# Altium schematic sheet 0196_LPSS - SMLINK OPTI.SchDoc
size A3
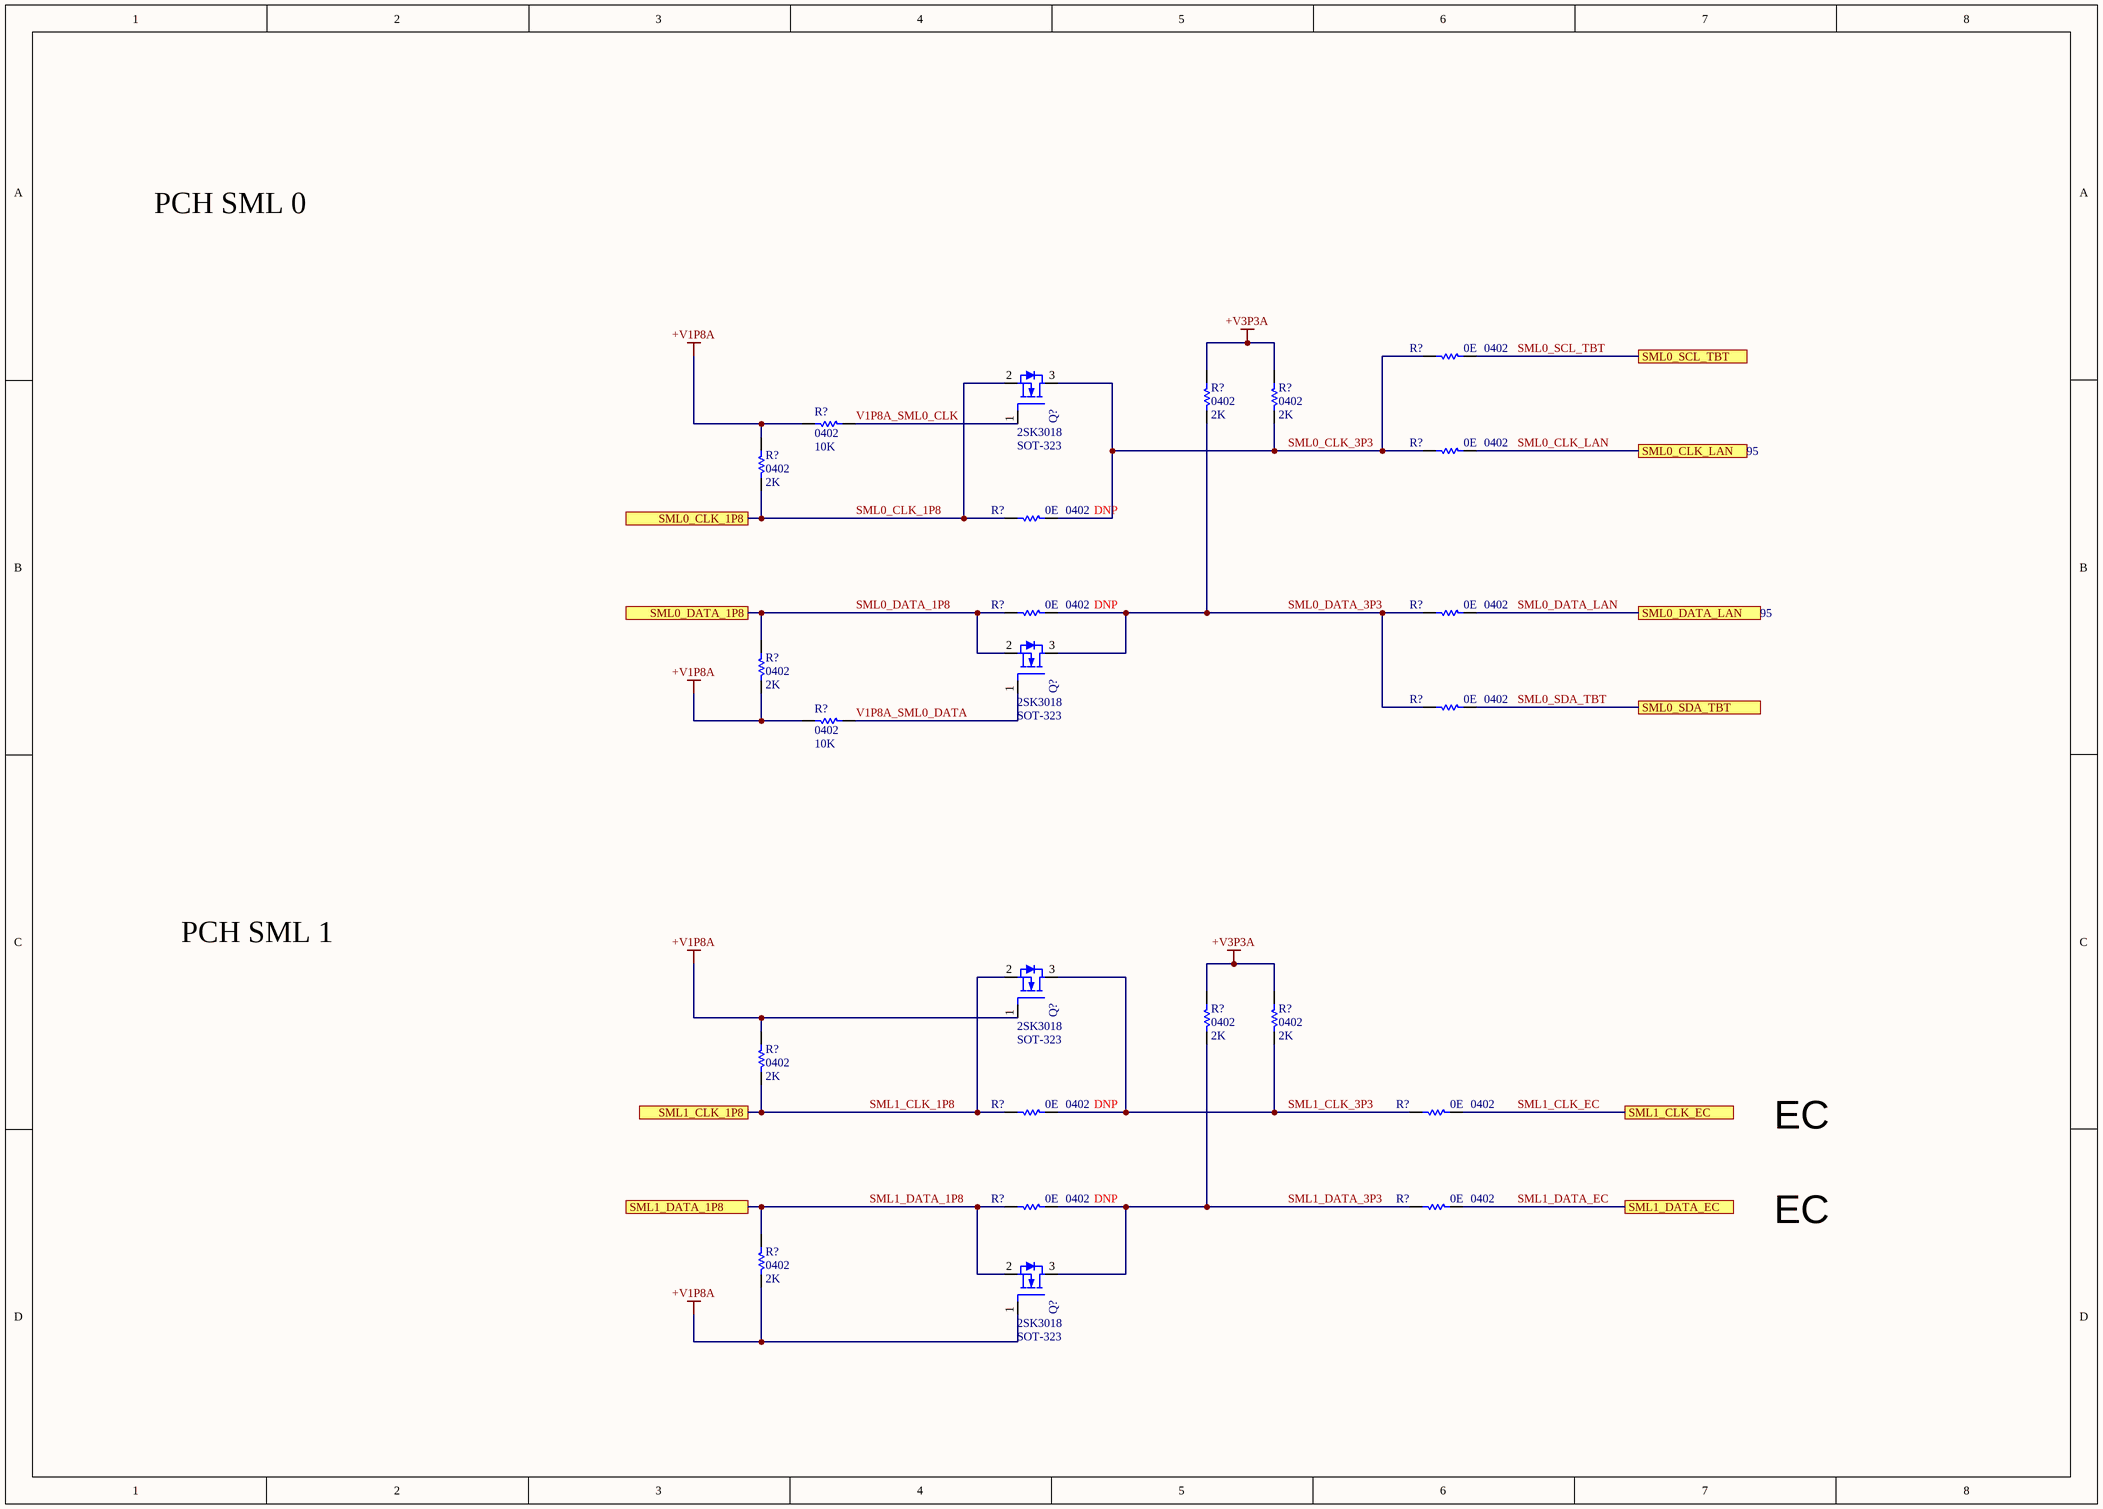
[diagram p0: 0196_LPSS - SMLINK OPTI.SchDoc]

## Parts
(Parts that share a designator on the sheet are numbered #1, #2 ... from top to bottom, then left to right.)
Q?#1  Manufacturer Part Number: 2SK3018  Case/Package: SOT-323  [SOT323]  (hidden comment: MOSFET N_2SK3018)
Q?#2  Manufacturer Part Number: 2SK3018  Case/Package: SOT-323  [SOT323]  (hidden comment: MOSFET N_2SK3018)
Q?#3  Manufacturer Part Number: 2SK3018  Case/Package: SOT-323  [SOT323]  (hidden comment: MOSFET N_2SK3018)
Q?#4  Manufacturer Part Number: 2SK3018  Case/Package: SOT-323  [SOT323]  (hidden comment: MOSFET N_2SK3018)
R?#1  value 0E  Case/Package: 0402  [RESC0402]  (hidden comment: Res)
R?#2  value 2K  Case/Package: 0402  [RESC0402]  (hidden comment: Res)
R?#3  value 2K  Case/Package: 0402  [RESC0402]  (hidden comment: Res)
R?#4  value 10K  Case/Package: 0402  [RESC0402]  (hidden comment: Res)
R?#5  value 0E  Case/Package: 0402  [RESC0402]  (hidden comment: Res)
R?#6  value 2K  Case/Package: 0402  [RESC0402]  (hidden comment: Res)
R?#7  value 0E  Case/Package: 0402  [RESC0402]  (hidden comment: Res)
R?#8  value 0E  Case/Package: 0402  [RESC0402]  (hidden comment: Res)
R?#9  value 0E  Case/Package: 0402  [RESC0402]  (hidden comment: Res)
R?#10  value 2K  Case/Package: 0402  [RESC0402]  (hidden comment: Res)
R?#11  value 0E  Case/Package: 0402  [RESC0402]  (hidden comment: Res)
R?#12  value 10K  Case/Package: 0402  [RESC0402]  (hidden comment: Res)
R?#13  value 2K  Case/Package: 0402  [RESC0402]  (hidden comment: Res)
R?#14  value 2K  Case/Package: 0402  [RESC0402]  (hidden comment: Res)
R?#15  value 2K  Case/Package: 0402  [RESC0402]  (hidden comment: Res)
R?#16  value 0E  Case/Package: 0402  [RESC0402]  (hidden comment: Res)
R?#17  value 0E  Case/Package: 0402  [RESC0402]  (hidden comment: Res)
R?#18  value 0E  Case/Package: 0402  [RESC0402]  (hidden comment: Res)
R?#19  value 0E  Case/Package: 0402  [RESC0402]  (hidden comment: Res)
R?#20  value 2K  Case/Package: 0402  [RESC0402]  (hidden comment: Res)

## Ports
SML0_CLK_1P8, SML0_CLK_LAN, SML0_DATA_1P8, SML0_DATA_LAN, SML0_SCL_TBT, SML0_SDA_TBT, SML1_CLK_1P8, SML1_CLK_EC, SML1_DATA_1P8, SML1_DATA_EC

## Nets
+V1P8A: Q?#3.1(GATE) Q?#4.1(GATE) R?#4.2 R?#6.1 R?#10.2 R?#12.2 R?#15.1 R?#20.2
+V3P3A: R?#2.1 R?#3.1 R?#13.1 R?#14.1
SML0_CLK_1P8: Q?#1.2(SOURCE) R?#6.2 R?#7.1 ; port SML0_CLK_1P8
SML0_CLK_3P3: Q?#1.3(DRAIN) R?#1.1 R?#3.2 R?#5.1 R?#7.2
SML0_CLK_LAN: R?#5.2 ; port SML0_CLK_LAN
SML0_DATA_1P8: Q?#2.2(SOURCE) R?#8.1 R?#10.1 ; port SML0_DATA_1P8
SML0_DATA_3P3: Q?#2.3(DRAIN) R?#2.2 R?#8.2 R?#9.1 R?#11.1
SML0_DATA_LAN: R?#9.2 ; port SML0_DATA_LAN
SML0_SCL_TBT: R?#1.2 ; port SML0_SCL_TBT
SML0_SDA_TBT: R?#11.2 ; port SML0_SDA_TBT
SML1_CLK_1P8: Q?#3.2(SOURCE) R?#15.2 R?#16.1 ; port SML1_CLK_1P8
SML1_CLK_3P3: Q?#3.3(DRAIN) R?#14.2 R?#16.2 R?#17.1
SML1_CLK_EC: R?#17.2 ; port SML1_CLK_EC
SML1_DATA_1P8: Q?#4.2(SOURCE) R?#18.1 R?#20.1 ; port SML1_DATA_1P8
SML1_DATA_3P3: Q?#4.3(DRAIN) R?#13.2 R?#18.2 R?#19.1
SML1_DATA_EC: R?#19.2 ; port SML1_DATA_EC
V1P8A_SML0_CLK: Q?#1.1(GATE) R?#4.1
V1P8A_SML0_DATA: Q?#2.1(GATE) R?#12.1

## Notes on the sheet
- PCH SML 0
- PCH SML 1
- EC

## Library data of the parts
Q?#1-Q?#4 = MOSFET N_2SK3018: NMOS,2SK3018,SOT_323,Id=0.1A,Vds=30V
R?#1 R?#5 R?#7-R?#9 R?#11 R?#16-R?#19 = Res: Thick Film Resistor -  0ohm, 1%, 0402
  R?#7 R?#8 R?#16 R?#18: DNP: DNP
R?#2 R?#3 R?#6 R?#10 R?#13-R?#15 R?#20 = Res: Thick Film Resistor -  2Kohm, 1%, 0402
R?#4 R?#12 = Res: Thick Film Resistor -  10Kohm, 1%, 0402